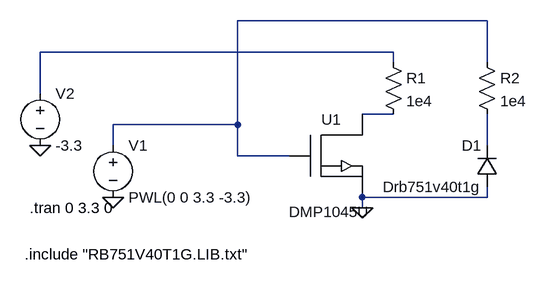
[diagram p0: schematic DeviceCurves.asc]
DeviceCurves.asc, the LTspice schematic file:
Version 4.1
SHEET 1 880 680
WIRE 512 -96 128 -96
WIRE 368 -48 -176 -48
WIRE 368 -32 368 -48
WIRE 512 -32 512 -96
WIRE -176 16 -176 -48
WIRE 368 48 320 48
WIRE 128 64 128 -96
WIRE 128 64 -64 64
WIRE -64 96 -64 64
WIRE 512 96 512 48
WIRE 128 112 128 64
WIRE 208 112 128 112
WIRE 512 176 512 160
WIRE 512 176 320 176
WIRE 320 192 320 176
FLAG -64 176 0
FLAG 320 192 0
FLAG -176 96 0
SYMBOL voltage -64 80 R0
WINDOW 123 0 0 Left 0
WINDOW 39 0 0 Left 0
SYMATTR InstName V1
SYMATTR Value PWL(0 0 3.3 -3.3)
SYMBOL DMP1045U 272 112 M0
SYMATTR InstName U1
SYMBOL voltage -176 0 R0
WINDOW 123 0 0 Left 0
WINDOW 39 0 0 Left 0
SYMATTR InstName V2
SYMATTR Value -3.3
SYMBOL res 352 -48 R0
SYMATTR InstName R1
SYMATTR Value 1e4
SYMBOL diode 528 160 R180
WINDOW 0 24 64 Left 2
WINDOW 3 24 0 Left 2
SYMATTR InstName D1
SYMATTR Value Drb751v40t1g
SYMBOL res 496 -48 R0
SYMATTR InstName R2
SYMATTR Value 1e4
TEXT -200 264 Left 2 !.include "RB751V40T1G.LIB.txt"
TEXT -192 192 Left 2 !.tran 0 3.3 0

The netlist it stands for:
* DeviceCurves.asc
V1 N001 0 PWL(0 0 3.3 -3.3)
X§U1 N003 N001 0 DMP1045U
V2 N002 0 -3.3
R1 N002 N003 1e4
D1 0 N004 Drb751v40t1g
R2 N001 N004 1e4
.model D D
.lib standard.dio
.include "RB751V40T1G.LIB.txt"
.tran 0 3.3 0
.lib .\DMP1045U.spice.txt
.backanno
.end